# EAGLE design LAMEBOY (EAGLE 7.6.0)

## Sheet 1 of 2
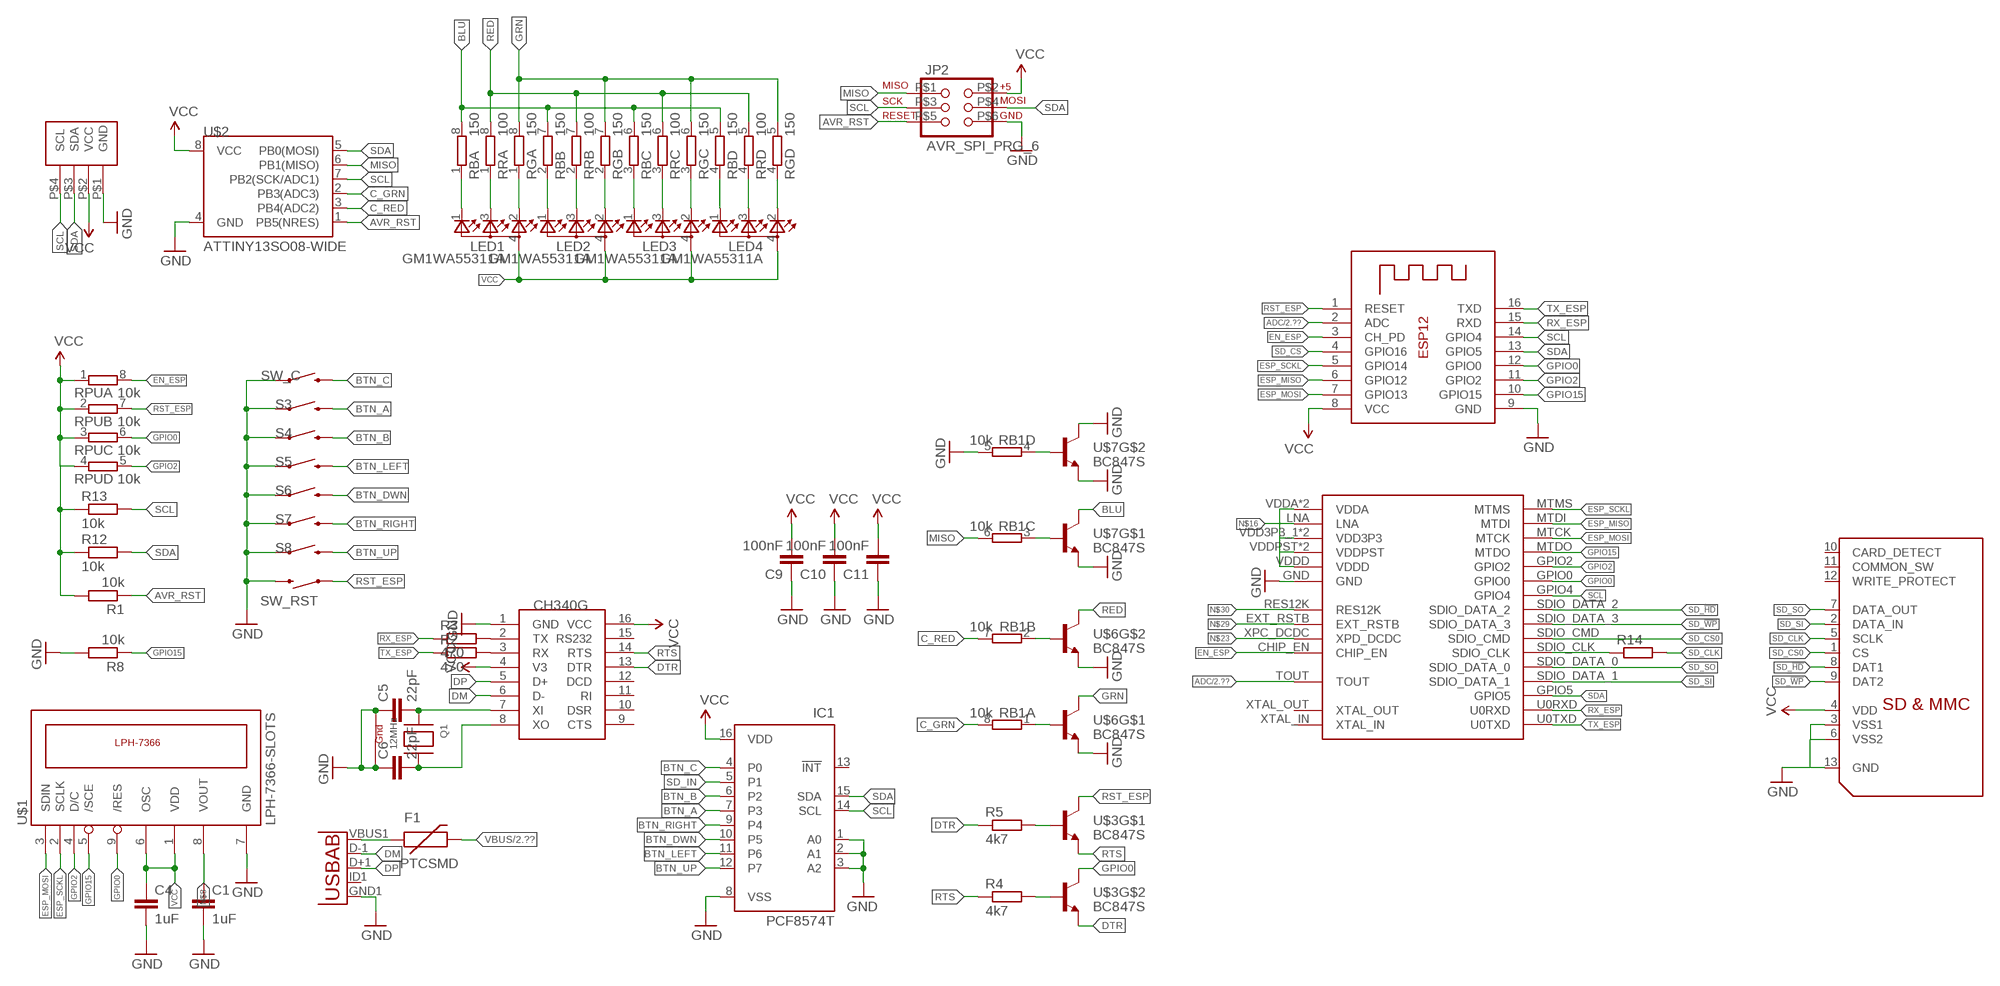
[diagram p0: schematic, sheet 1]

### Parts
C1  1uF  C-EUONEFITSALL  [ONEFITSALL]
C4  1uF  C-EUONEFITSALL  [ONEFITSALL]
C5  22pF  C-EUONEFITSALL  [ONEFITSALL]
C6  22pF  C-EUONEFITSALL  [ONEFITSALL]
C9  100nF  C-EUONEFITSALL  [ONEFITSALL]
C10  100nF  C-EUONEFITSALL  [ONEFITSALL]
C11  100nF  C-EUONEFITSALL  [ONEFITSALL]
CH340G  CH340GCH340G  [SOIC16]
F1  PTCSMD  [PTC-1206]
IC1  PCF8574T  [SO16W]
JP2  AVR_SPI_PRG_6  [2X3_SMD_PAD]
LED1  GM1WA55311A  [GM1WA55311A]
LED2  GM1WA55311A  [GM1WA55311A]
LED3  GM1WA55311A  [GM1WA55311A]
LED4  GM1WA55311A  [GM1WA55311A]
Q1  12MHz  XTAL-4BIGGER  [NX3225_BIGGER]
R1  10k  R-EU_ONEFITSALL  [ONEFITSALL]
R2  470  R-EU_ONEFITSALL  [ONEFITSALL]
R3  470  R-EU_ONEFITSALL  [ONEFITSALL]
R4  4k7  R-EU_ONEFITSALL  [ONEFITSALL]
R5  4k7  R-EU_ONEFITSALL  [ONEFITSALL]
R8  10k  R-EU_ONEFITSALL  [ONEFITSALL]
R12  10k  R-EU_ONEFITSALL  [ONEFITSALL]
R13  10k  R-EU_ONEFITSALL  [ONEFITSALL]
R14  R-EU_R0603  [R0603]
RB  150  4R-N0603-ARC  [0603-ARC]
RB1  10k  4R-N0603-ARC  [0603-ARC]
RG  150  4R-N0603-ARC  [0603-ARC]
RPU  10k  4R-N0603-ARC  [0603-ARC]
RR  100  4R-N0603-ARC  [0603-ARC]
S3  SWITCH-MOMENTARY-2SMD-4  [TACTILE_SWITCH_TALL]
S4  SWITCH-MOMENTARY-2SMD-4  [TACTILE_SWITCH_TALL]
S5  SWITCH-MOMENTARY-2SMD-4  [TACTILE_SWITCH_TALL]
S6  SWITCH-MOMENTARY-2SMD-4  [TACTILE_SWITCH_TALL]
S7  SWITCH-MOMENTARY-2SMD-4  [TACTILE_SWITCH_TALL]
S8  SWITCH-MOMENTARY-2SMD-4  [TACTILE_SWITCH_TALL]
SW_C  SWITCH-MOMENTARY-2-SMD-1101NE  [TACTILE-SWITCH-1101NE]
SW_RST  SWITCH-MOMENTARY-2-SMD-1101NE  [TACTILE-SWITCH-1101NE]
U2  USB  USB-ABCONN-11794  [USB-AB-MICRO-SMD_V03]
U$1  LPH-7366-SLOTS  [LPH-7366-SLOTS]
U$2  ATTINY13SO08-WIDE  [SO08-EIAJ]
U$3  BC847S  MMDT3904  [SOT363]
U$6  BC847S  MMDT3904  [SOT363]
U$7  BC847S  MMDT3904  [SOT363]
U$10  I2C_GROVE  [I2C_GROVE]
U$13  ESP8266EX  [ESP8266EX]
U$14  SDMMCSCDA  [SCDA]
X1  ESP-12  [ESP-12]

### Nets
ADC: U$13.TOUT X1.2(ADC) ; also sheet 2
AVR_RST: JP2.P$5 R1.P$1 U$2.1(PB5(NRES))
BLU: RB.5 RB.6 RB.7 RB.8 U$7.3(C)
BTN_A: IC1.7(P3) S3.B2
BTN_B: IC1.6(P2) S4.B2
BTN_C: IC1.4(P0) SW_C.P$2
BTN_DWN: IC1.10(P5) S6.B2
BTN_LEFT: IC1.11(P6) S5.B2
BTN_RIGHT: IC1.9(P4) S7.B2
BTN_UP: IC1.12(P7) S8.B2
C_GRN: RB1.8 U$2.2(PB3(ADC3))
C_RED: RB1.7 U$2.3(PB4(ADC2))
DM: CH340G.6(D-) U2.D-1(D-)
DP: CH340G.5(D+) U2.D+1(D+)
DTR: CH340G.13(DTR) R5.P$1 U$3.1(E)
EN_ESP: RPU.8 U$13.CHIP_EN X1.3(CH_PD)
ESP_MISO: U$13.MTDI X1.6(GPIO12)
ESP_MOSI: U$1.3(SDIN) U$13.MTCK X1.7(GPIO13)
ESP_SCKL: U$1.2(SCLK) U$13.MTMS X1.5(GPIO14)
GND: C1.P$2 C4.P$2 C5.P$1 C6.P$1 C9.P$1 C10.P$1 C11.P$1 CH340G.1(GND) IC1.1(A0) IC1.2(A1) IC1.3(A2) IC1.8(VSS) JP2.P$6 Q1.2(G2) Q1.4(G1) R8.P$2 RB1.5 S3.A2 S4.A2 S5.A2 S6.A2 S7.A2 S8.A2 SW_C.P$1 SW_RST.P$2 U2.GND1(GND) U$1.7(GND) U$2.4(GND) U$6.1(E) U$6.4(E) U$7.1(E) U$7.4(E) U$7.6(C) U$10.P$1(GND) U$13.GND U$14.3(VSS1) U$14.6(VSS2) U$14.13(GND) X1.9(GND) ; also sheet 2
GPIO0: RPU.6 U$1.9(/RES) U$3.6(C) U$13.GPIO0 X1.12(GPIO0)
GPIO2: RPU.5 U$1.4(D/C) U$13.GPIO2 X1.11(GPIO2)
GPIO15: R8.P$1 U$1.5(/SCE) U$13.MTDO X1.10(GPIO15)
GRN: RG.5 RG.6 RG.7 RG.8 U$6.3(C)
L2_R: LED1.3(CBLUE) RR.1
L3_B: LED1.1(CGREEN) RB.1
L4_G: LED1.2(CRED) RG.1
MISO: JP2.P$1 RB1.6 U$2.6(PB1(MISO))
N$1: LED4.1(CGREEN) RB.4
N$2: LED4.3(CBLUE) RR.4
N$3: LED4.2(CRED) RG.4
N$4: LED3.1(CGREEN) RB.3
N$5: LED3.3(CBLUE) RR.3
N$6: LED3.2(CRED) RG.3
N$7: LED2.1(CGREEN) RB.2
N$8: C1.P$1 U$1.8(VOUT)
N$9: LED2.3(CBLUE) RR.2
N$10: LED2.2(CRED) RG.2
N$11: RB1.1 U$6.5(B)
N$13: RB1.2 U$6.2(B)
N$14: U$13.VDD3P3_1(VDD3P3) U$13.VDD3P3_2(VDD3P3) U$13.VDDA U$13.VDDA_2(VDDA) U$13.VDDD U$13.VDDPST U$13.VDDPST_2(VDDPST)
N$16: U$13.LNA
N$17: C5.P$2 CH340G.7(XI) Q1.1(X1)
N$18: RB1.3 U$7.5(B)
N$19: RB1.4 U$7.2(B)
N$22: R14.1 U$13.SDIO_CLK
N$23: U$13.XPC_DCDC(XPD_DCDC)
N$24: C6.P$2 CH340G.8(XO) Q1.3(X2)
N$25: R5.P$2 U$3.5(B)
N$26: CH340G.3(RX) R2.P$2
N$27: CH340G.2(TX) R3.P$2
N$28: R4.P$2 U$3.2(B)
N$29: U$13.EXT_RSTB
N$30: U$13.RES12K
RED: RR.5 RR.6 RR.7 RR.8 U$6.6(C)
RST_ESP: RPU.7 SW_RST.P$1 U$3.3(C) X1.1(RESET)
RTS: CH340G.14(RTS) R4.P$1 U$3.4(E)
RX_ESP: R3.P$1 U$13.U0RXD X1.15(RXD)
SCL: IC1.14(SCL) JP2.P$3 R13.P$2 U$2.7(PB2(SCK/ADC1)) U$10.P$4(SCL) U$13.GPIO4 X1.14(GPIO4)
SD_!HD: U$13.SDIO_DATA_2 U$14.8(DAT1)
SD_!WP: U$13.SDIO_DATA_3 U$14.9(DAT2)
SD_CLK: R14.2 U$14.5(SCLK)
SD_CS: X1.4(GPIO16)
SD_CS0: U$13.SDIO_CMD U$14.1(CS)
SD_IN: IC1.5(P1)
SD_SI: U$13.SDIO_DATA_1 U$14.2(DATA_IN)
SD_SO: U$13.SDIO_DATA_0 U$14.7(DATA_OUT)
SDA: IC1.15(SDA) JP2.P$4 R12.P$2 U$2.5(PB0(MOSI)) U$10.P$3(SDA) U$13.GPIO5 X1.13(GPIO5)
TX_ESP: R2.P$1 U$13.U0TXD X1.16(TXD)
VBUS: F1.2 ; also sheet 2
VCC: C4.P$1 C9.P$2 C10.P$2 C11.P$2 CH340G.4(V3) CH340G.16(VCC) IC1.16(VDD) JP2.P$2 LED1.4(A) LED2.4(A) LED3.4(A) LED4.4(A) R1.P$2 R12.P$1 R13.P$1 RPU.1 RPU.2 RPU.3 RPU.4 U$1.1(VDD) U$1.6(OSC) U$2.8(VCC) U$10.P$2(VCC) U$14.4(VDD) X1.8(VCC) ; also sheet 2
VUSB: F1.1 U2.VBUS1(VBUS)
Unconnected: CH340G.9(CTS) CH340G.10(DSR) CH340G.11(RI) CH340G.12(DCD) CH340G.15(RS232) IC1.13(!INT) U2.ID1(USBID) U$13.XTAL_IN U$13.XTAL_OUT U$14.10(CARD_DETECT) U$14.11(COMMON_SW) U$14.12(WRITE_PROTECT)

## Sheet 2 of 2
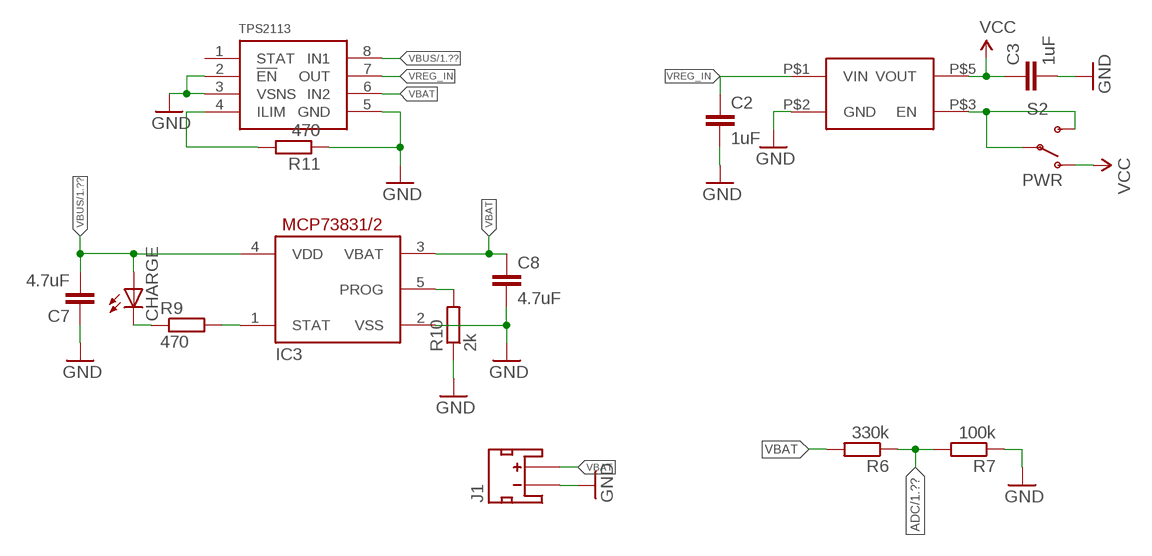
[diagram p1: schematic, sheet 2]

### Parts
C2  1uF  C-EUONEFITSALL  [ONEFITSALL]
C3  1uF  C-EUONEFITSALL  [ONEFITSALL]
C7  4.7uF  C-EUONEFITSALL  [ONEFITSALL]
C8  4.7uF  C-EUONEFITSALL  [ONEFITSALL]
CHARGE  LEDCHIP-LED0805  [CHIP-LED0805]
IC3  MCP73831  MCP73831/OT  [SOT23-5L]
J1  JST_2MM_MALE  [JST-2-SMD]
R6  330k  R-EU_ONEFITSALL  [ONEFITSALL]
R7  100k  R-EU_ONEFITSALL  [ONEFITSALL]
R9  470  R-EU_ONEFITSALL  [ONEFITSALL]
R10  2k  R-EU_ONEFITSALL  [ONEFITSALL]
R11  470  R-EU_ONEFITSALL  [ONEFITSALL]
S2  PWR  SWITCH-SPDT-SMD-A  [SWITCH-SPST-SMD-A]
U$4  TPS2113-PW  [TEXAS-PW]
U$9  AP2112KAP2112K  [AP2112]

### Nets
ADC: R6.P$1 R7.P$2 ; also sheet 1
GND: C2.P$2 C3.P$2 C7.P$1 C8.P$2 IC3.2(VSS) J1.1(-) R7.P$1 R10.P$1 R11.P$1 U$4.2(!EN) U$4.3(VSNS) U$4.5(GND) U$9.P$2(GND) ; also sheet 1
N$12: IC3.1(STAT) R9.P$2
N$15: CHARGE.C R9.P$1
N$20: R11.P$2 U$4.4(ILIM)
N$21: IC3.5(PROG) R10.P$2
VBAT: C8.P$1 IC3.3(VBAT) J1.2(+) R6.P$2 U$4.6(IN2)
VBUS: C7.P$2 CHARGE.A IC3.4(VDD) U$4.8(IN1) ; also sheet 1
VCC: C3.P$1 S2.1(O) U$9.P$5(VOUT) ; also sheet 1
VREG_EN: S2.2(P) S2.3(S) U$9.P$3(EN)
VREG_IN: C2.P$1 U$4.7(OUT) U$9.P$1(VIN)
Unconnected: J1.NC1(PAD1) J1.NC2(PAD2) U$4.1(STAT)

## Library data of the parts
C1-C11 = rcl:C-EU: CAPACITOR, European symbol
CH340G = ch340g:CH340G: USB to TTL RS232 converter
CHARGE = led:LED: LED OSRAM: - CHIPLED LG R971, LG N971, LY N971, LG Q971, LY Q971, LO R971, LY R971 LH N974, LH R974 LS Q976, LO Q976, LY Q976 LO Q996 - Hyper CHIPLED LW Q18S LB Q993, LB Q99A, LB R99A - SideLED LS A670, LO A670, LY A670, LG A670, LP A670 LB A673, LV A673, LT A673, LW A673 LH A674 LY A675 LS A676, LA A676, LO A676, LY A676, LW A676 LS A679, LY A679, LG A679 - Hyper Micro SIDELED® LS Y876, LA Y876, LO Y876, LY Y876 LT Y87S - SmartLED LW L88C, LW L88S LB L89C, LB L89S, LG L890 LS L89K, LO L89K, LY L89K LS L896, LA L896, LO L896, LY L896 - TOPLED LS T670, LO T670, LY T670, LG T670, LP T670 LSG T670, LSP T670, LSY T670, LOP T670, LYG T670 LG T671, LOG T671, LSG T671 LB T673, LV T673, LT T673, LW T673 LH T674 LS T676, LA T676, LO T676, LY T676, LB T676, LH T676, LSB T676, LW T676 LB T67C, LV T67C, LT T67C, LS T67K, LO T67K, LY T67K, LW E67C LS E67B, LA E67B, LO E67B, LY E67B, LB E67C, LV E67C, LT E67C LW T67C LS T679, LY T679, LG T679 LS T770, LO T770, LY T770, LG T770, LP T770 LB T773, LV T773, LT T773, LW T773 LH T774 LS E675, LA E675, LY E675, LS T675 LS T776, LA T776, LO T776, LY T776, LB T776 LHGB T686 LT T68C, LB T68C - Hyper Mini TOPLED® LB M676 - Mini TOPLED Santana® LG M470 LS M47K, LO M47K, LY M47K Source: http://www.osram.convergy.de LUXEON: - LUMILED® LXK2-PW12-R00, LXK2-PW12-S00, LXK2-PW14-U00, LXK2-PW14-V00 LXK2-PM12-R00, LXK2-PM12-S00, LXK2-PM14-U00 LXK2-PE12-Q00, LXK2-PE12-R00, LXK2-PE12-S00, LXK2-PE14-T00, LXK2-PE14-U00 LXK2-PB12-K00, LXK2-PB12-L00, LXK2-PB12-M00, LXK2-PB14-N00, LXK2-PB14-P00, LXK2-PB14-Q00 LXK2-PR12-L00, LXK2-PR12-M00, LXK2-PR14-Q00, LXK2-PR14-R00 LXK2-PD12-Q00, LXK2-PD12-R00, LXK2-PD12-S00 LXK2-PH12-R00, LXK2-PH12-S00 LXK2-PL12-P00, LXK2-PL12-Q00, LXK2-PL12-R00 Source: www.luxeon.com KINGBRIGHT: KA-3528ASYC Source: www.kingbright.com
F1 = SparkFun-PowerIC:PTC: Resettable Fuse PTC Resettable Fuse. Spark Fun Electronics SKU : COM-08357; PROD_ID: RES-11150
IC1 = micro-philips:PCF8574: I2C-Bus Remote 8-bit I/O expander http://www.semiconductors.philips.com/acrobat_download/datasheets/PCF8574_4.pdf; MPN: PCF8574T/3,512; OC_FARNELL: 1201255; OC_NEWARK: 70R6870
IC3 = adafruit:MCP73831: MCP73831/2 Miniature Single-Cell, Fully Integrated Li-Ion, Li-Polymer Charge Management Controllers. Nice and small simple lipoly charge controller, with adjustable current and status output (LED) http://www.ladyada.net/library/pcb/eaglelibrary.html
J1 = SparkFun-Connectors:JST_2MM_MALE: Mates to single-cell LiPo batteries. CONN-08352; PROD_ID: CONN-08352
JP2 = SparkFun-Connectors:AVR_SPI_PRG_6: AVR ISP 6 Pin This is the reduced ISP connector for AVR programming. Common on Arduino. This footprint will take up less PCB space and can be used with a 10-pin to 6-pin adapter such as SKU: BOB-08508 **Special note about "TEST_POINT" package. The stop mask is on the top side, so if you want your programming test points to be on the bottom of your board, make sure to place this package on the bottom side of the board. This also ensure that the orientation to program from the bottom side will be correct.
LED1-LED4 = led:GM1WA55311A: Chip LED RGB Source: http://document.sharpsma.com/files/GM1WA55311A_SS.pdf
Q1 = adafruit:XTAL-4: Classic 4-pin 3.2 x 2.5mm crystal
R1-R14 = rcl:R-EU_: RESISTOR, European symbol
RB RB1 RG RPU RR = resistor-dil:4R-N: Array Chip Resistor Source: RS Component / Phycomp; OC_FARNELL: unknown; OC_NEWARK: unknown
S2 = SparkFun-Electromechanical:SWITCH-SPDT: SPDT Switch Simple slide switch, Spark Fun Electronics SKU : COM-00102 DPDT SMT slide switch, AYZ0202, SWCH-08179
S3-S8 = SparkFun-Electromechanical:SWITCH-MOMENTARY-2: Various NO switches- pushbuttons, reed, etc; PROD_ID: SWCH-11966
SW_C SW_RST = SparkFun-Electromechanical:SWITCH-MOMENTARY-2: Various NO switches- pushbuttons, reed, etc
U2 = SparkFun-Connectors:USB-AB: This is a USB AB connector that is compatible with USB OTG. i.e. this connector can serve as a host or device; PROD_ID: CONN-11794
U$1 = lph-7366:LPH-7366-SLOTS
U$2 = SparkFun-DigitalIC:ATTINY13: Atmel 8-pin 1kB flash uC
U$3 U$6 U$7 = SparkFun-DiscreteSemi:MMDT3904: Dual NPN transistor
U$4 = TPS2113:TPS2113-PW
U$9 = TPS2113:AP2112K
U$10 = TPS2113:I2C_GROVE
U$13 = ESP8266EX:ESP8266EX
U$14 = adafruit:SDMMC: SD MMC Card holder 4UCON part #06132 - easy to solder
X1 = adafruit:ESP-12

## Board
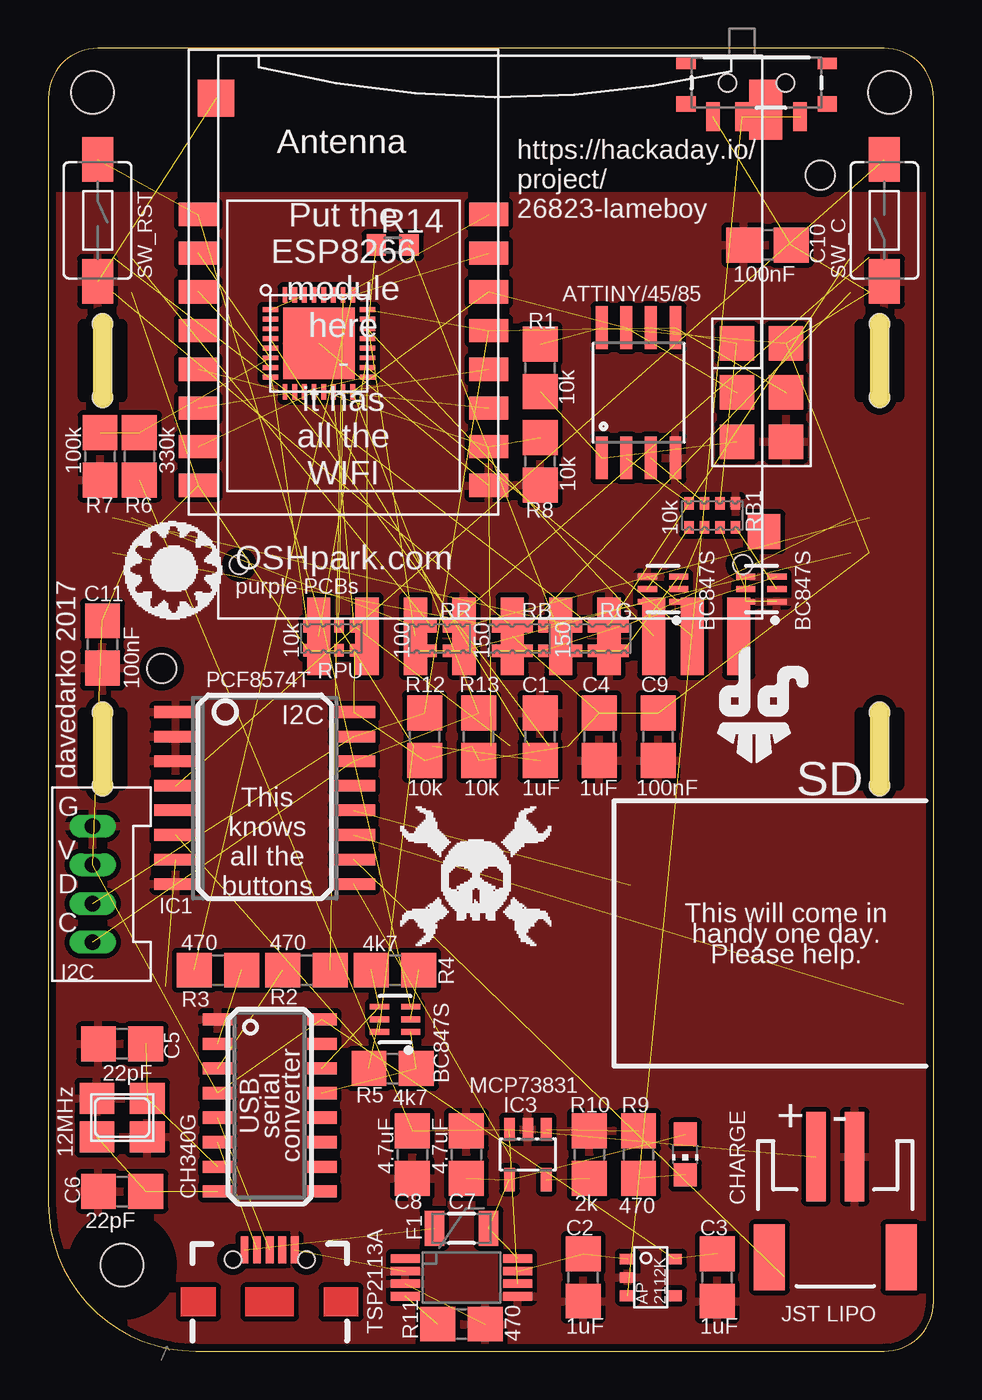
[diagram p2: board, top side]
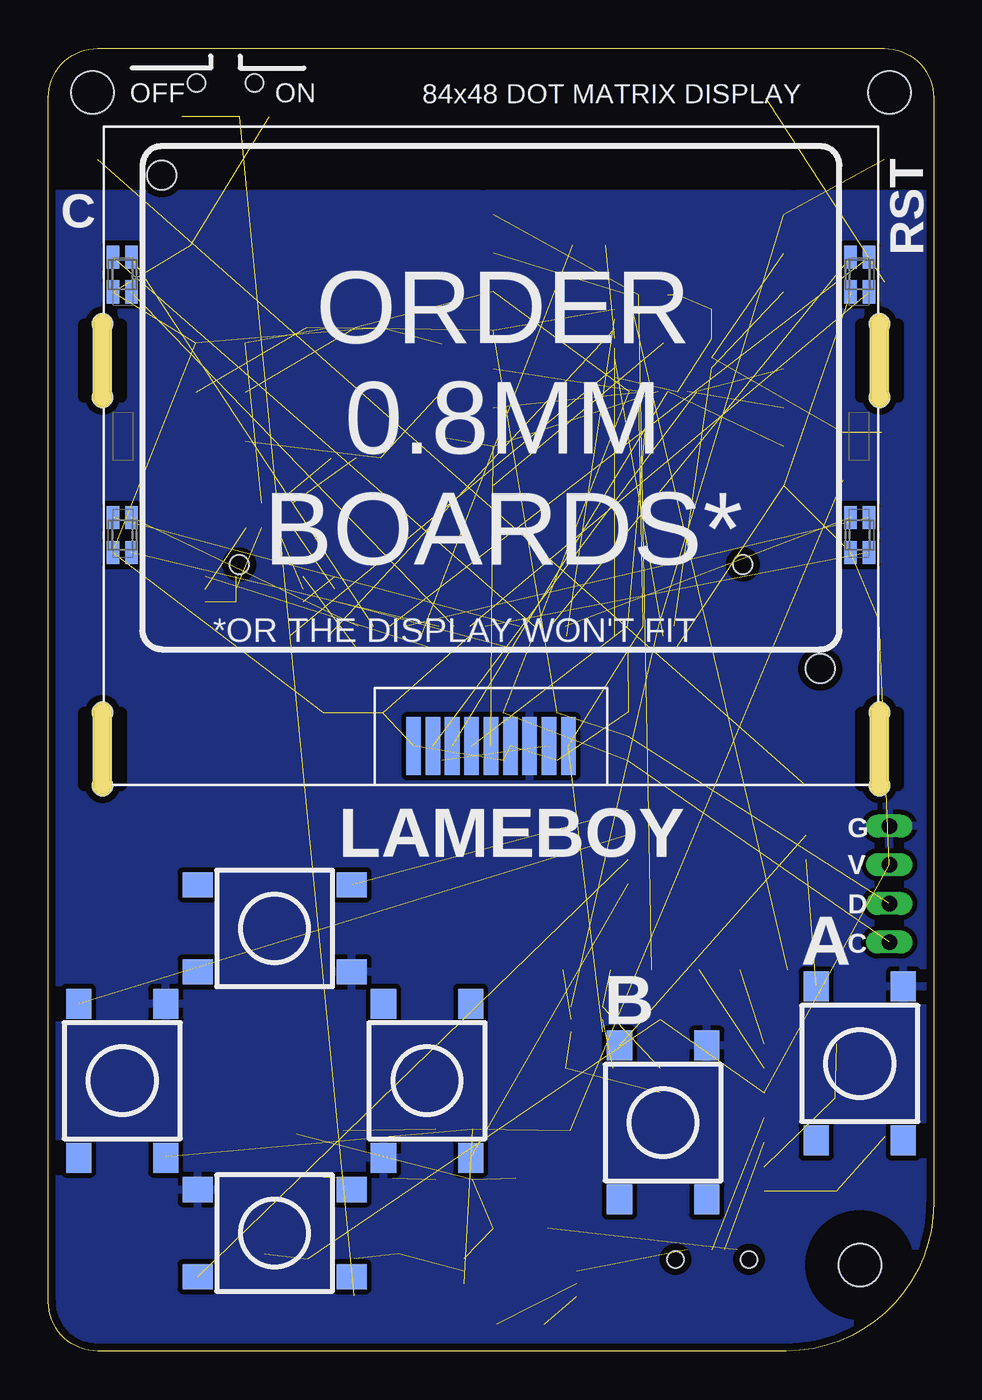
[diagram p3: board, bottom side, seen from below]

Size 45.72 x 67.31 mm. Coordinates in mm from the lower left corner, seen from the top.
Outline: 0,64.77 0,7.62 arc90 7.62,0 43.18,0 arc90 45.72,2.54 45.72,64.77 arc90 43.18,67.31 2.54,67.31 arc90 0,64.77
Copper layers (1*16): Top 0.0356mm / dielectric 1.5011mm / Bottom 0.0356mm
Design rules "LaenPCBOrder *": minimum track width 6mil, minimum drill 13mil, track to track 6mil, track to pad 6mil, pad to pad 6mil, via to via 6mil, smd to smd 6mil, copper to edge 15mil, drill to drill 6mil, minimum pad ring 7mil, minimum via ring 7mil, stop-mask expansion 3mil, vias tented up to drill 200mil, thermal gap 10mil
Holes 2.2 mm at 3.81,4.45 2.29,65.02 43.43,65.02
tRestrict: area 1.3,1.9 to 6.3,6.9
bRestrict: area 1.3,1.9 to 6.3,6.9

### Footprints (pad centres in the part's own frame; a part is rotated, then mirrored left to right if it is on the bottom)
ONEFITSALL = smd 1.8 x 1.8: P$1 -1.225,0; P$2 1.225,0
SOIC16 = smd 0.635 x 1.524: 1 -4.445,-2.695; 2 -3.175,-2.695; 3 -1.905,-2.695; 4 -0.635,-2.695; 5 0.635,-2.695; 6 1.905,-2.695; 7 3.175,-2.695; 8 4.445,-2.695; 9 4.445,2.695; 10 3.175,2.695; 11 1.905,2.695; 12 0.635,2.695; 13 -0.635,2.695; 14 -1.905,2.695; 15 -3.175,2.695; 16 -4.445,2.695
CHIP-LED0805 = smd 1.2 x 1.2: A 0,-1.05; C 0,1.05
PTC-1206 = smd 1 x 1.8: 1 -1.4,0; 2 1.4,0
SO16W = smd 0.6 x 2.2: 1 -4.445,-4.6; 2 -3.175,-4.6; 3 -1.905,-4.6; 4 -0.635,-4.6; 5 0.635,-4.6; 6 1.905,-4.6; 7 3.175,-4.6; 8 4.445,-4.6; 9 4.445,4.6; 10 3.175,4.6; 11 1.905,4.6; 12 0.635,4.6; 13 -0.635,4.6; 14 -1.905,4.6; 15 -3.175,4.6; 16 -4.445,4.6
SOT23-5L = smd 0.55 x 1.2: 1 -0.95,-1.3; 2 0,-1.3; 3 0.95,-1.3; 4 0.95,1.3; 5 -0.95,1.3
JST-2-SMD = smd 1 x 4.6: 1 -1,-3.7; 2 1,-3.7 | smd 1.6 x 3.4: NC1 -3.4,1.5; NC2 3.4,1.5
2X3_SMD_PAD = smd 1.778 x 1.778: P$1 -1.27,2.54; P$2 1.27,2.54; P$3 -1.27,0; P$4 1.27,0; P$5 -1.27,-2.54; P$6 1.27,-2.54
GM1WA55311A = smd 0.65 x 1.2: 1 -0.475,0.9; 2 -0.475,-0.9; 3 0.475,-0.9; 4 0.475,0.9
NX3225_BIGGER = smd 1.8 x 1.6: 1 -1.3,-1; 2 1.3,-1; 3 1.3,1; 4 -1.3,1
R0603 = smd 1 x 1.1: 1 -0.85,0; 2 0.85,0
0603-ARC = smd 0.5 x 0.65: 1 -1.2,-0.625; 2 -0.4,-0.625; 3 0.4,-0.625; 4 1.2,-0.625; 5 1.2,0.625; 6 0.4,0.625; 7 -0.4,0.625; 8 -1.2,0.625
SWITCH-SPST-SMD-A = smd 0.7 x 1.5: 1 -2.25,-1.75; 2 -0.75,-1.75; 3 2.25,-1.75 | smd 1 x 0.6: GND1 -3.65,1; GND3 3.65,1 | smd 1 x 0.8: GND2 -3.65,-1.1; GND4 3.65,-1.1 | hole 0.9: -1.5,0; 1.5,0
TACTILE_SWITCH_TALL = smd 1.55 x 1.3: A1 -3.975,-2.25; A2 3.975,-2.25; B1 -3.975,2.25; B2 3.975,2.25
TACTILE-SWITCH-1101NE = smd 2.3 x 1.6: P$1 -3.15,0; P$2 3.15,0
USB-AB-MICRO-SMD_V03 = smd 1.4 x 0.4: D+1 2.7,0; D-1 2.7,0.65; GND1 2.7,-1.3; ID1 2.7,-0.65; VBUS1 2.7,1.3 | hole 0.85: 2.2,1.9; 2.2,-1.9
LPH-7366-SLOTS = smd 0.75 x 3: 1 4,17; 2 3,17; 3 2,17; 4 1,17; 5 0,17; 6 -1,17; 7 -2,17; 8 -3,17; 9 -4,17 | hole 1.5: -17,13; 17,-12.5 | hole 1.016: -20.066,19.05; -20.066,15.24; 20.066,19.05; 20.066,15.24; 20.066,-1.016; 20.066,-4.826; -20.066,-1.016; -20.066,-4.826
SO08-EIAJ = smd 0.61 x 2.21: 1 -1.905,-3.378; 2 -0.635,-3.378; 3 0.635,-3.378; 4 1.905,-3.378; 5 1.905,3.353; 6 0.635,3.353; 7 -0.635,3.353; 8 -1.905,3.353
SOT363 = smd 0.3 x 0.99: 1 -0.65,-0.8; 2 0,-0.8; 3 0.65,-0.8; 4 0.65,0.81; 5 0,0.81; 6 -0.65,0.81
TEXAS-PW = smd 1.5 x 0.45: 1 -2.9,0.975; 2 -2.9,0.325; 3 -2.9,-0.325; 4 -2.9,-0.975; 5 2.9,-0.975; 6 2.9,-0.325; 7 2.9,0.325; 8 2.9,0.975
AP2112 = smd 0.55 x 0.8: P$1 0.95,1.2; P$2 0,1.2; P$3 -0.95,1.2; P$4 -0.95,-1.2; P$5 0.95,-1.2
I2C_GROVE = drill 0.8 long: P$1 0,3; P$2 0,1; P$3 0,-1; P$4 0,-3
ESP8266EX = smd 0.8 x 0.25: CHIP_EN -2.5,-1.25; GPIO5 2.5,1.75; LNA -2.5,1.25; SDIO_CLK 2.5,0.25; SDIO_CMD 2.5,-0.25; SDIO_DATA_0 2.5,0.75; SDIO_DATA_1 2.5,1.25; SDIO_DATA_2 2.5,-1.25; SDIO_DATA_3 2.5,-0.75; TOUT -2.5,-0.75; VDD3P3_1 -2.5,0.75; VDD3P3_2 -2.5,0.25; VDD_RTC -2.5,-0.25; VDDA -2.5,1.75; VDDPST_2 2.5,-1.75; XPC_DCDC -2.5,-1.75 | smd 0.25 x 0.8: EXT_RSTB -1.75,2.5; GPIO0 1.25,-2.5; GPIO2 0.75,-2.5; GPIO4 1.75,-2.5; MTCK -0.25,-2.5; MTDI -1.25,-2.5; MTDO 0.25,-2.5; MTMS -1.75,-2.5; RES12K -1.25,2.5; U0RXD 1.75,2.5; U0TXD 1.25,2.5; VDDA_2 -0.75,2.5; VDDD -0.25,2.5; VDDPST -0.75,-2.5; XTAL_IN 0.25,2.5; XTAL_OUT 0.75,2.5 | smd 3.7 x 3.7: GND 0,0
SCDA = smd 1.2 x 4: 1 6.4,3.7; 2 3.9,3.7; 3 1.4,3.7; 4 -1.1,3.7; 5 -3.6,3.7; 6 -6.1,3.7; 7 -8.4,3.7; 8 -10.4,3.7; 9 8.9,3.7; 10 -12.8,3.7 | smd 1.7 x 1.8: 11 -14.1,-1.7 | smd 1.7 x 3.1: 12 -14.2,-23.5 | smd 1.9 x 1.9: 13 14.2,-24.1 | hole 1: -13,0; 13,0
ESP-12 = smd 2 x 1.2: 1 -7.5,4.5; 2 -7.5,2.5; 3 -7.5,0.5; 4 -7.5,-1.5; 5 -7.5,-3.5; 6 -7.5,-5.5; 7 -7.5,-7.5; 8 -7.5,-9.5; 9 7.5,-9.5; 10 7.5,-7.5; 11 7.5,-5.5; 12 7.5,-3.5; 13 7.5,-1.5; 14 7.5,0.5; 15 7.5,2.5; 16 7.5,4.5

### Placement (x,y rotation side)
C1  25.4,31.75 90 top
C2  27.62,3.81 270 top
C3  34.54,3.81 270 top
C4  28.45,31.75 270 top
C5  3.81,15.88 0 top
C6  3.81,8.26 0 top
C7  21.59,10.16 270 top
C8  18.8,10.16 270 top
C9  31.5,31.75 90 top
C10  37.15,57.15 0 top
C11  2.79,36.51 90 top
CH340G  11.43,12.7 270 top
CHARGE  32.89,10.16 180 top
F1  21.34,6.35 0 top
IC1  11.18,28.57 270 top
IC3  24.77,10.16 180 top
J1  40.64,6.35 180 top
JP2  36.83,49.53 0 top
LED1  41.91,42.16 180 bottom
LED2  41.91,55.63 180 bottom
LED3  3.81,55.63 180 bottom
LED4  3.81,42.16 180 bottom
Q1  3.81,12.06 180 top
R1  25.4,50.8 90 top
R2  13.34,19.68 180 top
R3  8.76,19.68 0 top
R4  17.91,19.68 0 top
R5  17.78,14.61 180 top
R6  4.7,46.23 270 top
R7  2.67,46.23 90 top
R8  25.4,45.97 270 top
R9  30.48,10.16 90 top
R10  27.94,10.16 270 top
R11  21.34,1.4 180 top
R12  19.43,31.75 90 top
R13  22.23,31.75 90 top
R14  17.78,57.15 0 top
RB  24.36,36.82 180 top
RB1  34.29,43.18 0 top
RG  28.51,36.82 180 top
RPU  14.61,36.83 0 top
RR  20.21,36.82 180 top
S2  36.58,65.53 0 top
S3  3.81,14.86 90 bottom
S4  13.97,11.81 90 bottom
S5  41.91,13.97 90 bottom
S6  34.04,6.1 180 bottom
S7  26.16,13.97 270 bottom
S8  34.04,21.84 0 bottom
SW_C  43.18,58.42 90 top
SW_RST  2.54,58.42 270 top
U2  11.43,2.54 90 top
U$1  22.86,48.26 180 bottom
U$2  30.48,49.53 0 top
U$3  17.91,17.14 90 top
U$4  21.34,3.81 0 top
U$5  [OSHPARK_LOGO]  15.37,40.39 0 top
U$6  31.75,39.37 90 top
U$7  36.83,39.37 90 top
U$8  [DAVEDARKO_GOLD]  34.04,12.7 0 bottom
U$9  31.11,3.81 90 top
U$10  2.29,24.13 0 top
U$11  [DAVEDARKO2_LOGO]  36.45,32.64 0 top
U$12  [HACKADAY_LOGO]  22.03,24.19 0 top
U$13  13.97,52.07 0 top
U$14  22.86,40.64 180 top
X1  15.24,54.23 0 top

### Tracks (layer width: path | path; a pad name or v marks a point on that pad's centre or on a via)
ADC  (3 unrouted)
AVR_RST  (2 unrouted)
BLU  (4 unrouted)
BTN_A  (1 unrouted)
BTN_B  (1 unrouted)
BTN_C  (1 unrouted)
BTN_DWN  (1 unrouted)
BTN_LEFT  (1 unrouted)
BTN_RIGHT  (1 unrouted)
BTN_UP  (1 unrouted)
C_GRN  (1 unrouted)
C_RED  (1 unrouted)
DM  (1 unrouted)
DP  (1 unrouted)
DTR  (2 unrouted)
EN_ESP  (2 unrouted)
ESP_MISO  (1 unrouted)
ESP_MOSI  (2 unrouted)
ESP_SCKL  (2 unrouted)
GND  (7 unrouted)
  pour Bottom (isolate 0.254): -2.54,59.77 48.26,59.77 48.26,-5.08 -2.54,-5.08
  pour Top (isolate 0.254): -3.81,59.69 49.53,59.69 49.53,-2.54 -3.81,-2.54
GPIO0  (4 unrouted)
GPIO2  (3 unrouted)
GPIO15  (3 unrouted)
GRN  (4 unrouted)
L2_R  (1 unrouted)
L3_B  (1 unrouted)
L4_G  (1 unrouted)
MISO  (2 unrouted)
N$1  (1 unrouted)
N$2  (1 unrouted)
N$3  (1 unrouted)
N$4  (1 unrouted)
N$5  (1 unrouted)
N$6  (1 unrouted)
N$7  (1 unrouted)
N$8  (1 unrouted)
N$9  (1 unrouted)
N$10  (1 unrouted)
N$11  (1 unrouted)
N$12  (1 unrouted)
N$13  (1 unrouted)
N$14  (6 unrouted)
N$15  (1 unrouted)
N$17  (2 unrouted)
N$18  (1 unrouted)
N$19  (1 unrouted)
N$20  (1 unrouted)
N$21  (1 unrouted)
N$22  (1 unrouted)
N$24  (2 unrouted)
N$25  (1 unrouted)
N$26  (1 unrouted)
N$27  (1 unrouted)
N$28  (1 unrouted)
RED  (4 unrouted)
RST_ESP  (3 unrouted)
RTS  (2 unrouted)
RX_ESP  (2 unrouted)
SCL  (6 unrouted)
SD_!HD  (1 unrouted)
SD_!WP  (1 unrouted)
SD_CLK  (1 unrouted)
SD_CS0  (1 unrouted)
SD_SI  (1 unrouted)
SD_SO  (1 unrouted)
SDA  (6 unrouted)
TX_ESP  (2 unrouted)
VBAT  (4 unrouted)
VBUS  (4 unrouted)
VCC  (27 unrouted)
VREG_EN  (2 unrouted)
VREG_IN  (2 unrouted)
VUSB  (1 unrouted)

### Text on the board
tNames: https://hackaday.io/ / project/ / 26823-lameboy | ATTINY/45/85 | Put the / ESP8266 / module / here / - / it has / all the / WIFI | BC847S | BC847S | I2C | davedarko 2017 | SD | This / knows / all the / buttons | This will come in / handy one day. / Please help. | I2C | BC847S | USB / serial / converter | + - | 12MHz | CH340G | JST LIPO | TSP2113A
bNames: ON | OFF | 84x48 DOT MATRIX DISPLAY | C | RST | ORDER / 0.8MM / BOARDS* | *OR THE DISPLAY WON'T FIT | G | LAMEBOY | V | D | C | A | B